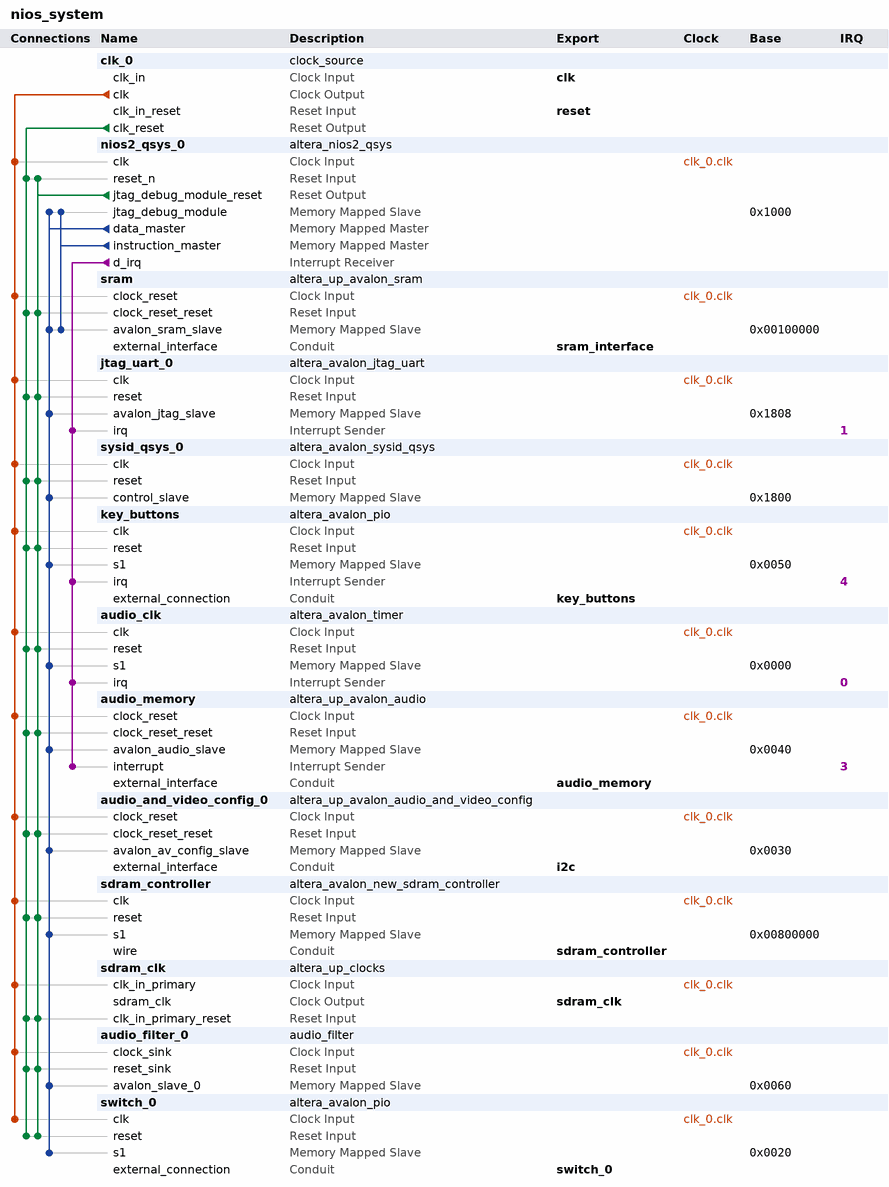
[diagram p0: system contents]
# Platform Designer (Qsys) system nios_system, Cyclone II EP2C35F672C6
# Parameters at their usual value, and those the tool derives, are not listed.
package require -exact qsys 13.0
create_system nios_system
set_project_property DEVICE_FAMILY {Cyclone II}
set_project_property DEVICE EP2C35F672C6

add_instance clk_0 clock_source 13.0
set_instance_parameter_value clk_0 clockFrequency 50000000

add_instance nios2_qsys_0 altera_nios2_qsys 13.0
set_instance_parameter_value nios2_qsys_0 resetSlave sram.avalon_sram_slave
set_instance_parameter_value nios2_qsys_0 mmu_TLBMissExcSlave None
set_instance_parameter_value nios2_qsys_0 exceptionSlave sram.avalon_sram_slave
set_instance_parameter_value nios2_qsys_0 breakSlave nios2_qsys_0.jtag_debug_module
set_instance_parameter_value nios2_qsys_0 impl Tiny
set_instance_parameter_value nios2_qsys_0 icache_size 4096

add_instance sram altera_up_avalon_sram 13.0
set_instance_parameter_value sram board DE2
set_instance_parameter_value sram pixel_buffer false

add_instance jtag_uart_0 altera_avalon_jtag_uart 13.0.1.99.2
set_instance_parameter_value jtag_uart_0 simInteractiveOptions NO_INTERACTIVE_WINDOWS

add_instance sysid_qsys_0 altera_avalon_sysid_qsys 13.0
set_instance_parameter_value sysid_qsys_0 id 4

add_instance key_buttons altera_avalon_pio 13.0.1.99.2
set_instance_parameter_value key_buttons captureEdge true
set_instance_parameter_value key_buttons direction Input
set_instance_parameter_value key_buttons edgeType FALLING
set_instance_parameter_value key_buttons generateIRQ true
set_instance_parameter_value key_buttons irqType EDGE
set_instance_parameter_value key_buttons width 1

add_instance audio_clk altera_avalon_timer 13.0.1.99.2
set_instance_parameter_value audio_clk alwaysRun true
set_instance_parameter_value audio_clk fixedPeriod true
set_instance_parameter_value audio_clk period 20.48
set_instance_parameter_value audio_clk periodUnits USEC
set_instance_parameter_value audio_clk snapshot false

add_instance audio_memory altera_up_avalon_audio 13.0
set_instance_parameter_value audio_memory avalon_bus_type {Memory Mapped}
set_instance_parameter_value audio_memory audio_in true
set_instance_parameter_value audio_memory dw 16

add_instance audio_and_video_config_0 altera_up_avalon_audio_and_video_config 13.0
set_instance_parameter_value audio_and_video_config_0 board DE2
set_instance_parameter_value audio_and_video_config_0 audio_in {Microphone to ADC}
set_instance_parameter_value audio_and_video_config_0 line_in_bypass true
set_instance_parameter_value audio_and_video_config_0 bit_length 16
set_instance_parameter_value audio_and_video_config_0 sampling_rate {48 kHz}

add_instance sdram_controller altera_avalon_new_sdram_controller 13.0.1.99.2
set_instance_parameter_value sdram_controller TAC 5.4
set_instance_parameter_value sdram_controller TRCD 20.0
set_instance_parameter_value sdram_controller TRP 20.0
set_instance_parameter_value sdram_controller casLatency 3
set_instance_parameter_value sdram_controller columnWidth 8
set_instance_parameter_value sdram_controller dataWidth 16
set_instance_parameter_value sdram_controller generateSimulationModel false
set_instance_parameter_value sdram_controller model single_Micron_MT48LC4M32B2_7_chip
set_instance_parameter_value sdram_controller numberOfBanks 4
set_instance_parameter_value sdram_controller numberOfChipSelects 1
set_instance_parameter_value sdram_controller powerUpDelay 100.0
set_instance_parameter_value sdram_controller refreshPeriod 31.25
set_instance_parameter_value sdram_controller rowWidth 12

add_instance sdram_clk altera_up_clocks 13.0
set_instance_parameter_value sdram_clk board DE2
set_instance_parameter_value sdram_clk vga_clk false
set_instance_parameter_value sdram_clk audio_clk false
set_instance_parameter_value sdram_clk audio_clk_freq 12.288

add_instance audio_filter_0 audio_filter 1.0

add_instance switch_0 altera_avalon_pio 13.0.1.99.2
set_instance_parameter_value switch_0 direction Input
set_instance_parameter_value switch_0 width 1

# connections
add_connection clk_0.clk audio_and_video_config_0.clock_reset clock
add_connection clk_0.clk audio_clk.clk clock
add_connection clk_0.clk audio_filter_0.clock_sink clock
add_connection clk_0.clk audio_memory.clock_reset clock
add_connection clk_0.clk jtag_uart_0.clk clock
add_connection clk_0.clk key_buttons.clk clock
add_connection clk_0.clk nios2_qsys_0.clk clock
add_connection clk_0.clk sdram_clk.clk_in_primary clock
add_connection clk_0.clk sdram_controller.clk clock
add_connection clk_0.clk sram.clock_reset clock
add_connection clk_0.clk switch_0.clk clock
add_connection clk_0.clk sysid_qsys_0.clk clock
add_connection clk_0.clk_reset audio_and_video_config_0.clock_reset_reset reset
add_connection clk_0.clk_reset audio_clk.reset reset
add_connection clk_0.clk_reset audio_filter_0.reset_sink reset
add_connection clk_0.clk_reset audio_memory.clock_reset_reset reset
add_connection clk_0.clk_reset jtag_uart_0.reset reset
add_connection clk_0.clk_reset key_buttons.reset reset
add_connection clk_0.clk_reset nios2_qsys_0.reset_n reset
add_connection clk_0.clk_reset sdram_clk.clk_in_primary_reset reset
add_connection clk_0.clk_reset sdram_controller.reset reset
add_connection clk_0.clk_reset sram.clock_reset_reset reset
add_connection clk_0.clk_reset switch_0.reset reset
add_connection clk_0.clk_reset sysid_qsys_0.reset reset
add_connection nios2_qsys_0.jtag_debug_module_reset audio_and_video_config_0.clock_reset_reset reset
add_connection nios2_qsys_0.jtag_debug_module_reset audio_clk.reset reset
add_connection nios2_qsys_0.jtag_debug_module_reset audio_filter_0.reset_sink reset
add_connection nios2_qsys_0.jtag_debug_module_reset audio_memory.clock_reset_reset reset
add_connection nios2_qsys_0.jtag_debug_module_reset jtag_uart_0.reset reset
add_connection nios2_qsys_0.jtag_debug_module_reset key_buttons.reset reset
add_connection nios2_qsys_0.jtag_debug_module_reset nios2_qsys_0.reset_n reset
add_connection nios2_qsys_0.jtag_debug_module_reset sdram_clk.clk_in_primary_reset reset
add_connection nios2_qsys_0.jtag_debug_module_reset sdram_controller.reset reset
add_connection nios2_qsys_0.jtag_debug_module_reset sram.clock_reset_reset reset
add_connection nios2_qsys_0.jtag_debug_module_reset switch_0.reset reset
add_connection nios2_qsys_0.jtag_debug_module_reset sysid_qsys_0.reset reset
add_connection nios2_qsys_0.data_master audio_and_video_config_0.avalon_av_config_slave avalon
set_connection_parameter_value nios2_qsys_0.data_master/audio_and_video_config_0.avalon_av_config_slave baseAddress 0x0030
add_connection nios2_qsys_0.data_master audio_clk.s1 avalon
set_connection_parameter_value nios2_qsys_0.data_master/audio_clk.s1 baseAddress 0x0000
add_connection nios2_qsys_0.data_master audio_filter_0.avalon_slave_0 avalon
set_connection_parameter_value nios2_qsys_0.data_master/audio_filter_0.avalon_slave_0 baseAddress 0x0060
add_connection nios2_qsys_0.data_master audio_memory.avalon_audio_slave avalon
set_connection_parameter_value nios2_qsys_0.data_master/audio_memory.avalon_audio_slave baseAddress 0x0040
add_connection nios2_qsys_0.data_master jtag_uart_0.avalon_jtag_slave avalon
set_connection_parameter_value nios2_qsys_0.data_master/jtag_uart_0.avalon_jtag_slave baseAddress 0x1808
add_connection nios2_qsys_0.data_master key_buttons.s1 avalon
set_connection_parameter_value nios2_qsys_0.data_master/key_buttons.s1 baseAddress 0x0050
add_connection nios2_qsys_0.data_master nios2_qsys_0.jtag_debug_module avalon
set_connection_parameter_value nios2_qsys_0.data_master/nios2_qsys_0.jtag_debug_module baseAddress 0x1000
add_connection nios2_qsys_0.data_master sdram_controller.s1 avalon
set_connection_parameter_value nios2_qsys_0.data_master/sdram_controller.s1 baseAddress 0x00800000
add_connection nios2_qsys_0.data_master sram.avalon_sram_slave avalon
set_connection_parameter_value nios2_qsys_0.data_master/sram.avalon_sram_slave baseAddress 0x00100000
add_connection nios2_qsys_0.data_master switch_0.s1 avalon
set_connection_parameter_value nios2_qsys_0.data_master/switch_0.s1 baseAddress 0x0020
add_connection nios2_qsys_0.data_master sysid_qsys_0.control_slave avalon
set_connection_parameter_value nios2_qsys_0.data_master/sysid_qsys_0.control_slave baseAddress 0x1800
add_connection nios2_qsys_0.instruction_master nios2_qsys_0.jtag_debug_module avalon
set_connection_parameter_value nios2_qsys_0.instruction_master/nios2_qsys_0.jtag_debug_module baseAddress 0x1000
add_connection nios2_qsys_0.instruction_master sram.avalon_sram_slave avalon
set_connection_parameter_value nios2_qsys_0.instruction_master/sram.avalon_sram_slave baseAddress 0x00100000
add_connection nios2_qsys_0.d_irq audio_clk.irq interrupt
set_connection_parameter_value nios2_qsys_0.d_irq/audio_clk.irq irqNumber 0
add_connection nios2_qsys_0.d_irq audio_memory.interrupt interrupt
set_connection_parameter_value nios2_qsys_0.d_irq/audio_memory.interrupt irqNumber 3
add_connection nios2_qsys_0.d_irq jtag_uart_0.irq interrupt
set_connection_parameter_value nios2_qsys_0.d_irq/jtag_uart_0.irq irqNumber 1
add_connection nios2_qsys_0.d_irq key_buttons.irq interrupt
set_connection_parameter_value nios2_qsys_0.d_irq/key_buttons.irq irqNumber 4

# exported interfaces
add_interface clk clock sink
set_interface_property clk EXPORT_OF clk_0.clk_in
add_interface reset reset sink
set_interface_property reset EXPORT_OF clk_0.clk_in_reset
add_interface key_buttons conduit end
set_interface_property key_buttons EXPORT_OF key_buttons.external_connection
add_interface audio_memory conduit end
set_interface_property audio_memory EXPORT_OF audio_memory.external_interface
add_interface i2c conduit end
set_interface_property i2c EXPORT_OF audio_and_video_config_0.external_interface
add_interface sdram_controller conduit end
set_interface_property sdram_controller EXPORT_OF sdram_controller.wire
add_interface sram_interface conduit end
set_interface_property sram_interface EXPORT_OF sram.external_interface
add_interface sdram_clk clock source
set_interface_property sdram_clk EXPORT_OF sdram_clk.sdram_clk
add_interface switch_0 conduit end
set_interface_property switch_0 EXPORT_OF switch_0.external_connection

set_interconnect_requirement {$system} qsys_mm.clockCrossingAdapter HANDSHAKE
set_interconnect_requirement {$system} qsys_mm.maxAdditionalLatency 1

save_system nios_system.qsys
